# Altium schematic sheet Robot-Power V4.0.SchDoc: Robot-Power
size A4; Date: 2019.6.25; Engineer: 淹死的鱼; Address1: ROV/AUV; Address2: V2.0; Address3: 淹死的鱼; DocumentNumber: P1; SheetNumber: 2
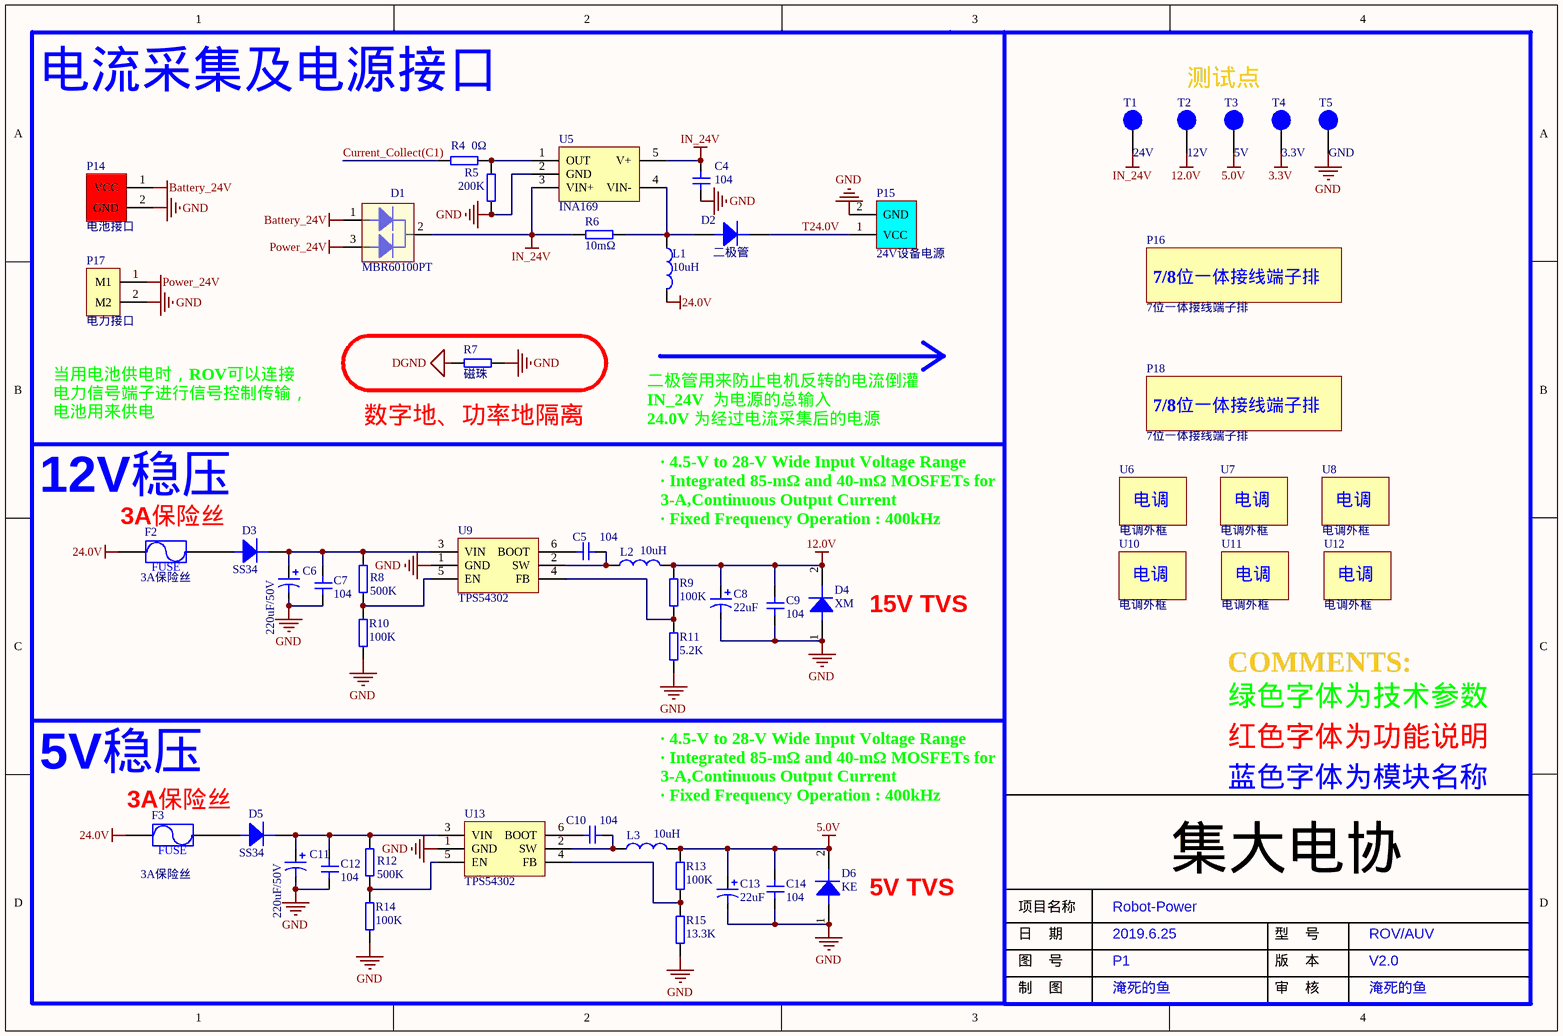
[diagram p0: Robot-Power V4.0.SchDoc]

## Parts
C4  104  [0805C]
C5  104  [0805C]
C6  220uF/50V  [RB.1.2]
C7  104  [0805C]
C8  22uF  [TAJ-C]
C9  104  [0805C]
C10  104  [0805C]
C11  220uF/50V  [RB.1.2]
C12  104  [0805C]
C13  22uF  [TAJ-C]
C14  104  [0805C]
D1  MBR60100PT  [TO-247LS]
D2  二极管  [二极管(大功率)]
D3  SS34  [SMA/DO-214AC]
D4  XM  [SMBJ]
D5  SS34  [SMA/DO-214AC]
D6  KE  [SMBJ]
F2  3A保险丝  [FUSE-1206]
F3  3A保险丝  [FUSE-1206]
L1  10uH  [CDRH124]
L2  10uH  [CDRH124]
L3  10uH  [CDRH124]
P14  电池接口  [XT60-F]
P15  24V设备电源  [XT60-F]
P16  7位一体接线端子排  [7/8一体接线端子]
P17  电力接口  [XT60-F]
P18  7位一体接线端子排  [7/8一体接线端子]
R4  0Ω  [0805R]
R5  200K  [0805R]
R6  10mΩ  [2512R]
R7  磁珠  [1210R]
R8  500K  [0805R]
R9  100K  [0805R]
R10  100K  [0805R]
R11  5.2K  [0805R]
R12  500K  [0805R]
R13  100K  [0805R]
R14  100K  [0805R]
R15  13.3K  [0805R]
T1  24V  [HEADER 1]
T2  12V  [HEADER 1]
T3  5V  [HEADER 1]
T4  3.3V  [HEADER 1]
T5  GND  [HEADER 1]
U5  INA169  [SOT23-5]
U6  电调外框  [电调外框]
U7  电调外框  [电调外框]
U8  电调外框  [电调外框]
U9  TPS54302  [SOT23-6]
U10  电调外框  [电调外框]
U11  电调外框  [电调外框]
U12  电调外框  [电调外框]
U13  TPS54302  [SOT23-6]

## Nets
3.3V: T4.1
5.0V: C13.1 C14.2 D6.2 L3.2 R13.2 T3.1
12.0V: C8.1 C9.2 D4.2 L2.2 R9.2 T2.1
24.0V: F2.1 F3.1 L1.2
Battery_24V: D1.1 P14.1(VCC)
DGND: R7.2
GND: C4.1 C6.2 C7.1 C8.2 C9.1 C11.2 C12.1 C13.2 C14.1 D4.1 D6.1 P14.2(GND) P15.2(GND) P17.2(M2) R5.2 R7.1 R10.1 R11.1 R14.1 R15.1 T5.1 U5.2(GND) U9.1(GND) U13.1(GND)
IN_24V: C4.2 D1.2 R6.2 T1.1 U5.3(VIN+) U5.5(V+)
Power_24V: D1.3 P17.1(M1)
Current_Collect(C1): R4.1
T24.0V: D2.2 P15.1(VCC)
NetC5_1: C5.1 L2.1 U9.2(SW)
NetC5_2: C5.2 U9.6(BOOT)
NetC6_1: C6.1 C7.2 D3.2 R8.2 U9.3(VIN)
NetC10_1: C10.1 L3.1 U13.2(SW)
NetC10_2: C10.2 U13.6(BOOT)
NetC11_1: C11.1 C12.2 D5.2 R12.2 U13.3(VIN)
NetD2_1: D2.1 L1.1 R6.1 U5.4(VIN-)
NetD3_1: D3.1 F2.2
NetD5_1: D5.1 F3.2
NetR4_2: R4.2 R5.1 U5.1(OUT)
NetR8_1: R8.1 R10.2 U9.5(EN)
NetR9_1: R9.1 R11.2 U9.4(FB)
NetR12_1: R12.1 R14.2 U13.5(EN)
NetR13_1: R13.1 R15.2 U13.4(FB)

## Notes on the sheet
- 电流采集及电源接口
- 测试点
- (near R7) 数字地、功率地隔离
- 二极管用来防止电机反转的电流倒灌
  IN_24V  为电源的总输入
  24.0V 为经过电流采集后的电源
- (near F2) 12V稳压
- 当用电池供电时，ROV可以连接
  电力信号端子进行信号控制传输，
  电池用来供电
- (near F2) 3A保险丝
- · 4.5-V to 28-V Wide Input Voltage Range
  · Integrated 85-mΩ and 40-mΩ MOSFETs for 3-A,Continuous Output Current
  · Fixed Frequency Operation : 400kHz
- (near D4) 15V TVS
- 绿色字体为技术参数
- COMMENTS:
- 5V稳压
- 红色字体为功能说明
- 蓝色字体为模块名称
- (near F3) 3A保险丝
- (near D6) 5V TVS
- 集大电协
- 项目名称
- 日    期
- 图    号
- 版    本
- 型    号
- 制    图
- 审    核
- (in symbol 7位一体接线端子排) 7/8位一体接线端子排
- (in symbol Fuse) FUSE

## Library data of the parts
C4 C5 C7 C9 C10 C12 C14 = Cap1: 无极贴片电容
C6 C11 = Cap3: 直插极性电容
C8 C13 = Pol Cap: 极性贴片电容
D2 = Diode
D3-D6 = Diode: 二极管
F2 F3 = Fuse: 保险丝
L1-L3 = L: 电感
P14 = 电源端子
P15 = 推进器电源
P17 = 接线端子-2PIN: 2PIN
R4-R15 = Res: 电阻
T1-T5 = 测试点
U6-U8 U10-U12 = 电调